# EAGLE design Production_SmartMic_V01 (EAGLE 9.2.2)

## Sheet 1 of 5
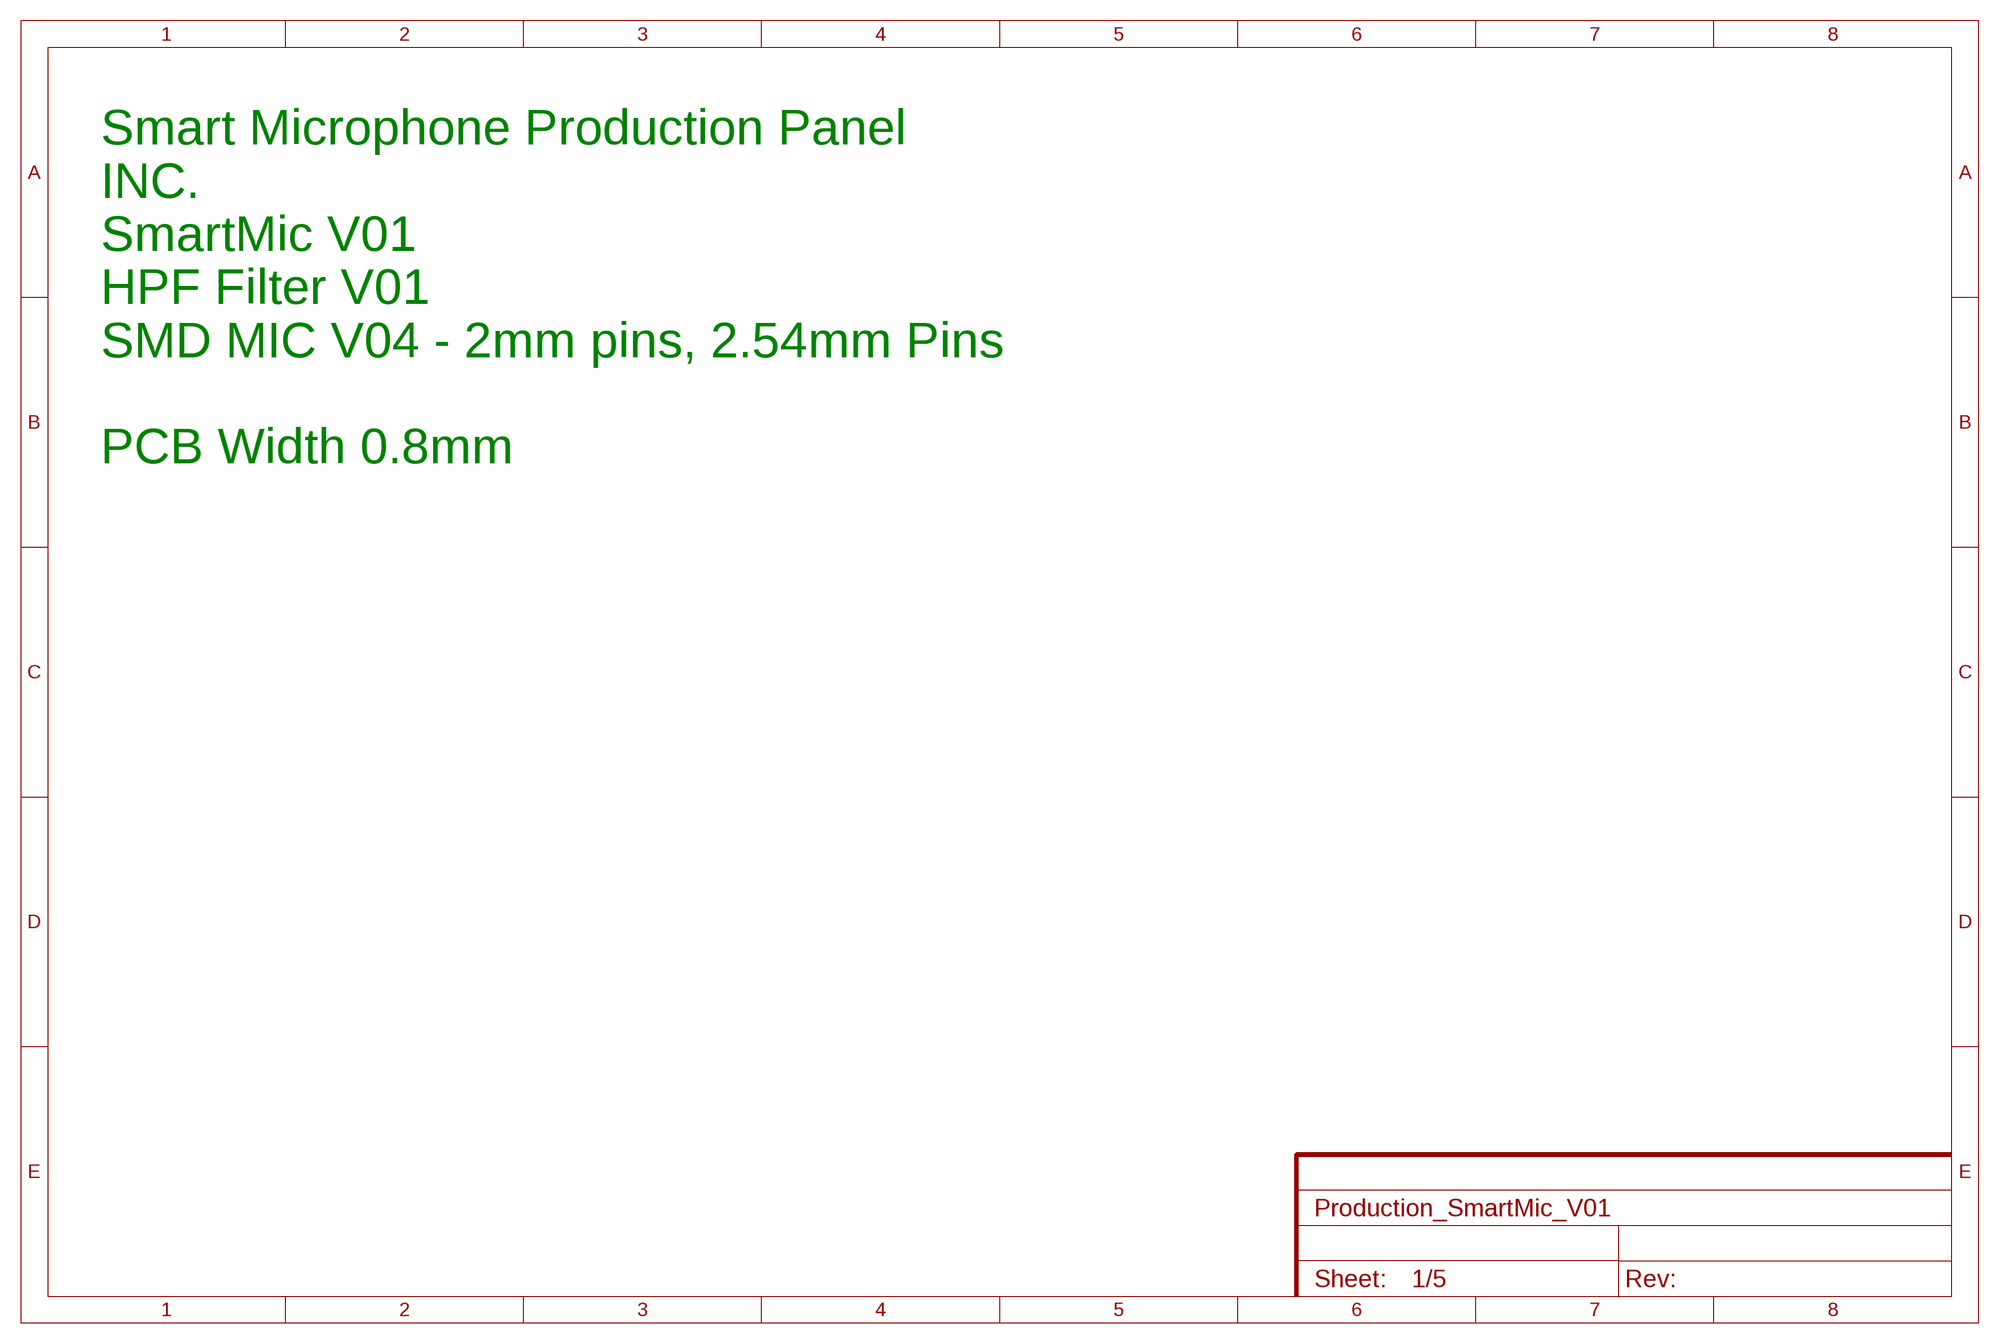
[diagram p0: schematic, sheet 1]

### Notes on the sheet
- Smart Microphone Production Panel
  INC.
  SmartMic V01
  HPF Filter V01
  SMD MIC V04 - 2mm pins, 2.54mm Pins
  
  PCB Width 0.8mm

## Sheet 2 of 5
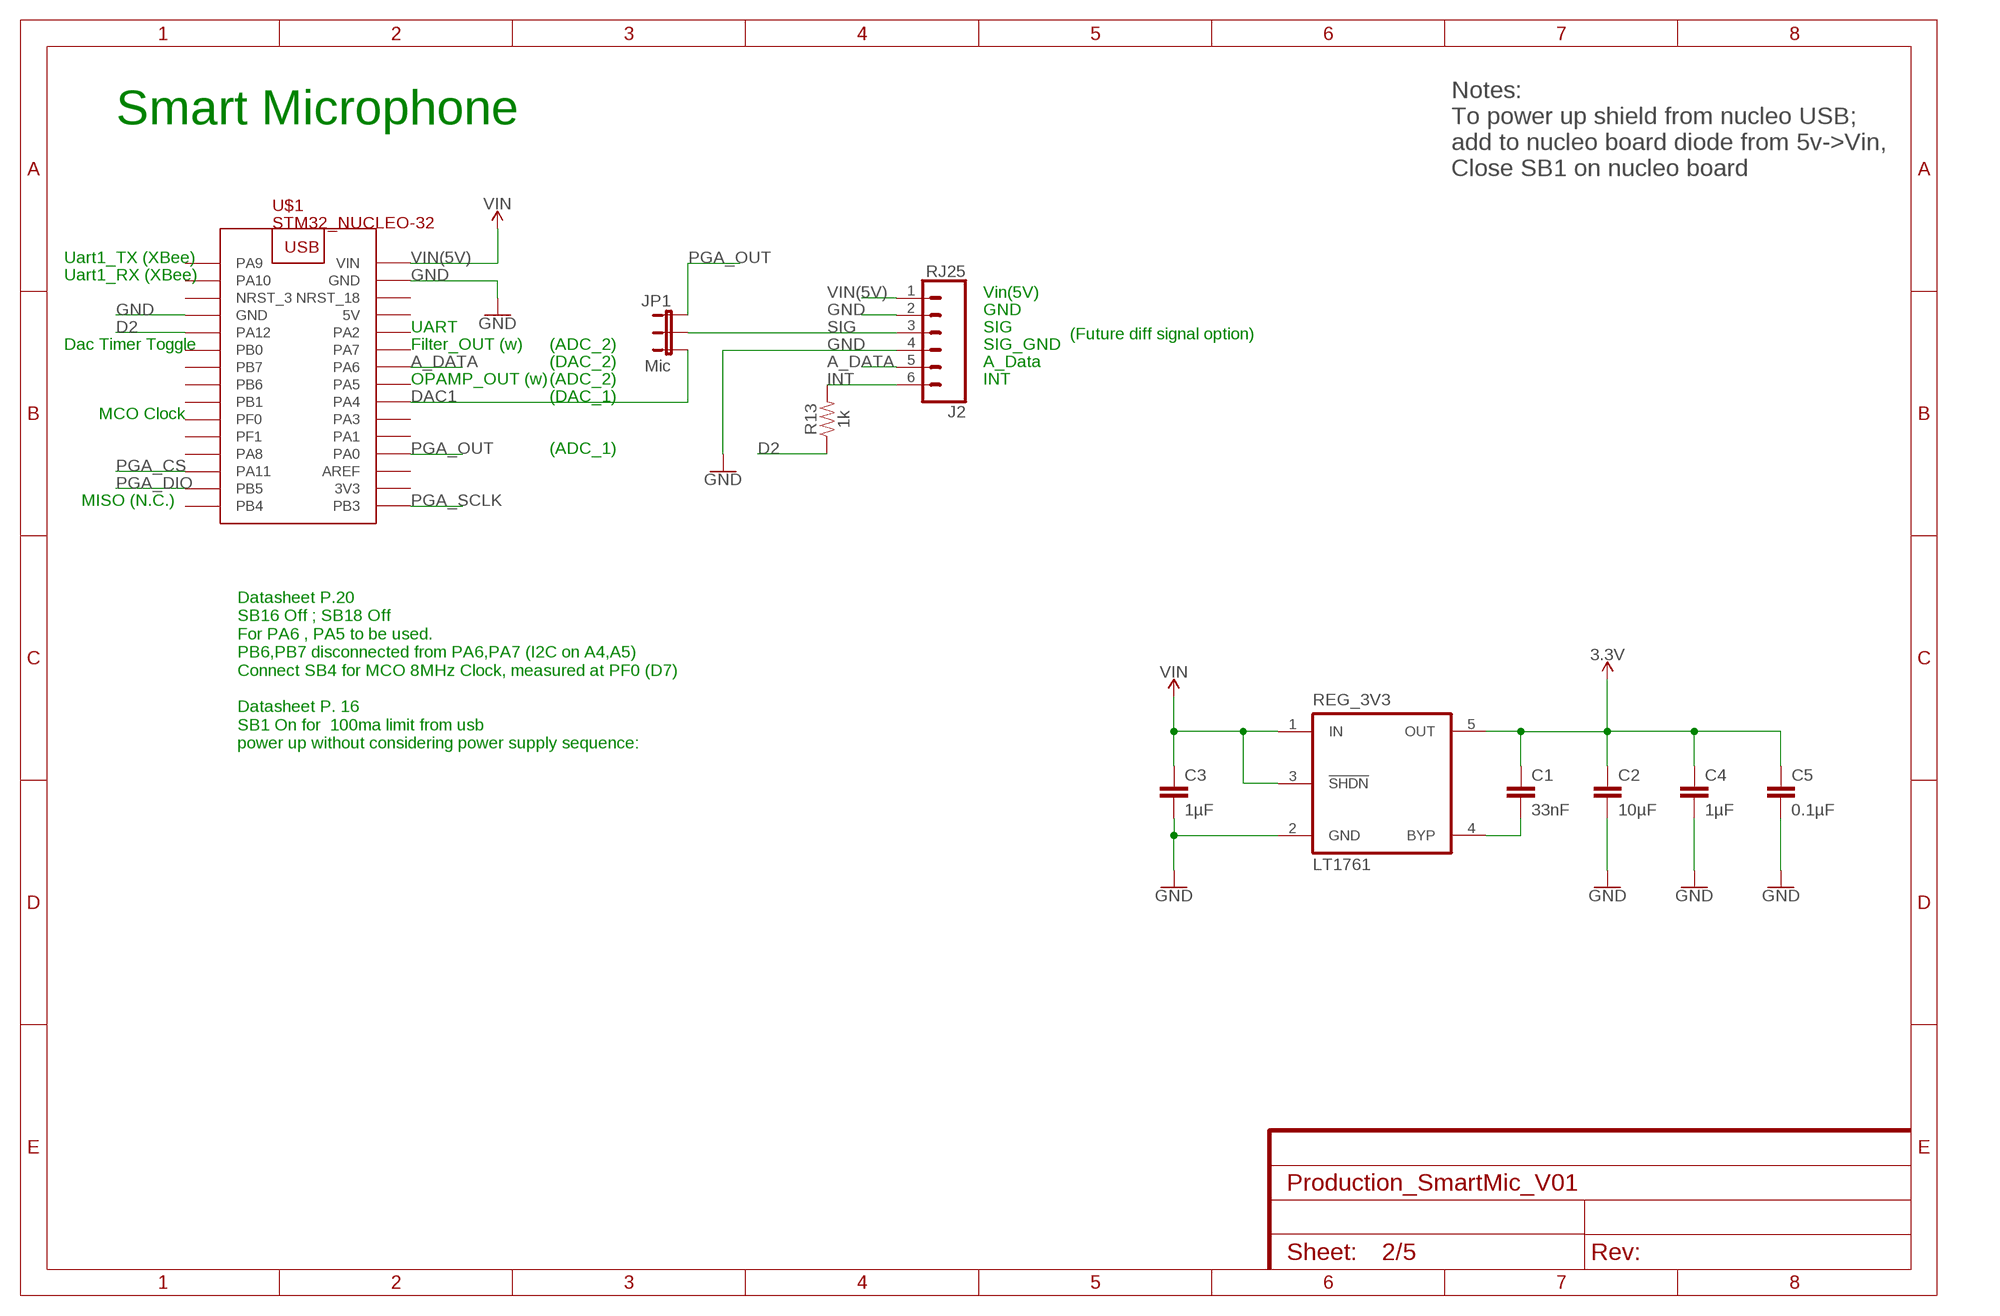
[diagram p1: schematic, sheet 2]

### Parts
C1  33nF  0.33UF/330NF-0805-50V-10%  [0805]
C2  10µF  0.33UF/330NF-0805-50V-10%  [0805]
C3  1µF  0.33UF/330NF-0805-50V-10%  [0805]
C4  1µF  0.33UF/330NF-0805-50V-10%  [0805]
C5  0.1µF  0.33UF/330NF-0805-50V-10%  [0805]
J2  RJ25  RJ11-6  [RJ11-6]
JP1  Mic  JUMPER-3PTH  [1X03]
R13  1k  RESISTOR0805  [0805]
REG_3V3  LT1761  [SOT23-5]
U$1  STM32_NUCLEO-32  [STM32_NUCLEO-32]

### Nets
3.3V: C1.1 C2.1 C4.1 C5.1 REG_3V3.5(OUT) ; also sheet 3,4
A_DATA: J2.5 U$1.PA6
BYP: C1.2 REG_3V3.4(BYP)
D2: R13.1 U$1.PA12
DAC1: JP1.3 U$1.PA4
GND: C2.2 C3.2 C4.2 C5.2 J2.2 J2.4 REG_3V3.2(GND) U$1.GND@4(GND) U$1.GND@17(GND) ; also sheet 3,4
INT: J2.6 R13.2
PGA_CS: U$1.PA11 ; also sheet 3
PGA_DIO: U$1.PB5 ; also sheet 3
PGA_OUT: JP1.1 U$1.PA0 ; also sheet 3
PGA_SCLK: U$1.PB3 ; also sheet 3
SIG: J2.3 JP1.2
VIN(5V): C3.1 J2.1 REG_3V3.1(IN) REG_3V3.3(!SHDN!) U$1.VIN ; supply symbol labelled VIN
Unconnected: U$1.AREF U$1.NRST_3 U$1.NRST_18 U$1.PA1 U$1.PA2 U$1.PA3 U$1.PA5 U$1.PA7 U$1.PA8 U$1.PA9 U$1.PA10 U$1.PB0 U$1.PB1 U$1.PB4 U$1.PB6 U$1.PB7 U$1.PF0 U$1.PF1

### Notes on the sheet
- Smart Microphone
- Notes:
  To power up shield from nucleo USB; 
  add to nucleo board diode from 5v->Vin,
  Close SB1 on nucleo board
- Uart1_TX (XBee)
- Uart1_RX (XBee)
- Vin(5V)
- GND
- UART | SIG
- (Future diff signal option)
- Dac Timer Toggle | Filter_OUT (w) | (ADC_2) | SIG_GND
- (DAC_2) | A_Data
- OPAMP_OUT (w) | (ADC_2) | INT
- (DAC_1)
- MCO Clock
- (ADC_1)
- MISO (N.C.)
- Datasheet P.20
  SB16 Off ; SB18 Off
  For PA6 , PA5 to be used.
  PB6,PB7 disconnected from PA6,PA7 (I2C on A4,A5)
  Connect SB4 for MCO 8MHz Clock, measured at PF0 (D7)
  
  Datasheet P. 16
  SB1 On for  100ma limit from usb 
  power up without considering power supply sequence:

## Sheet 3 of 5
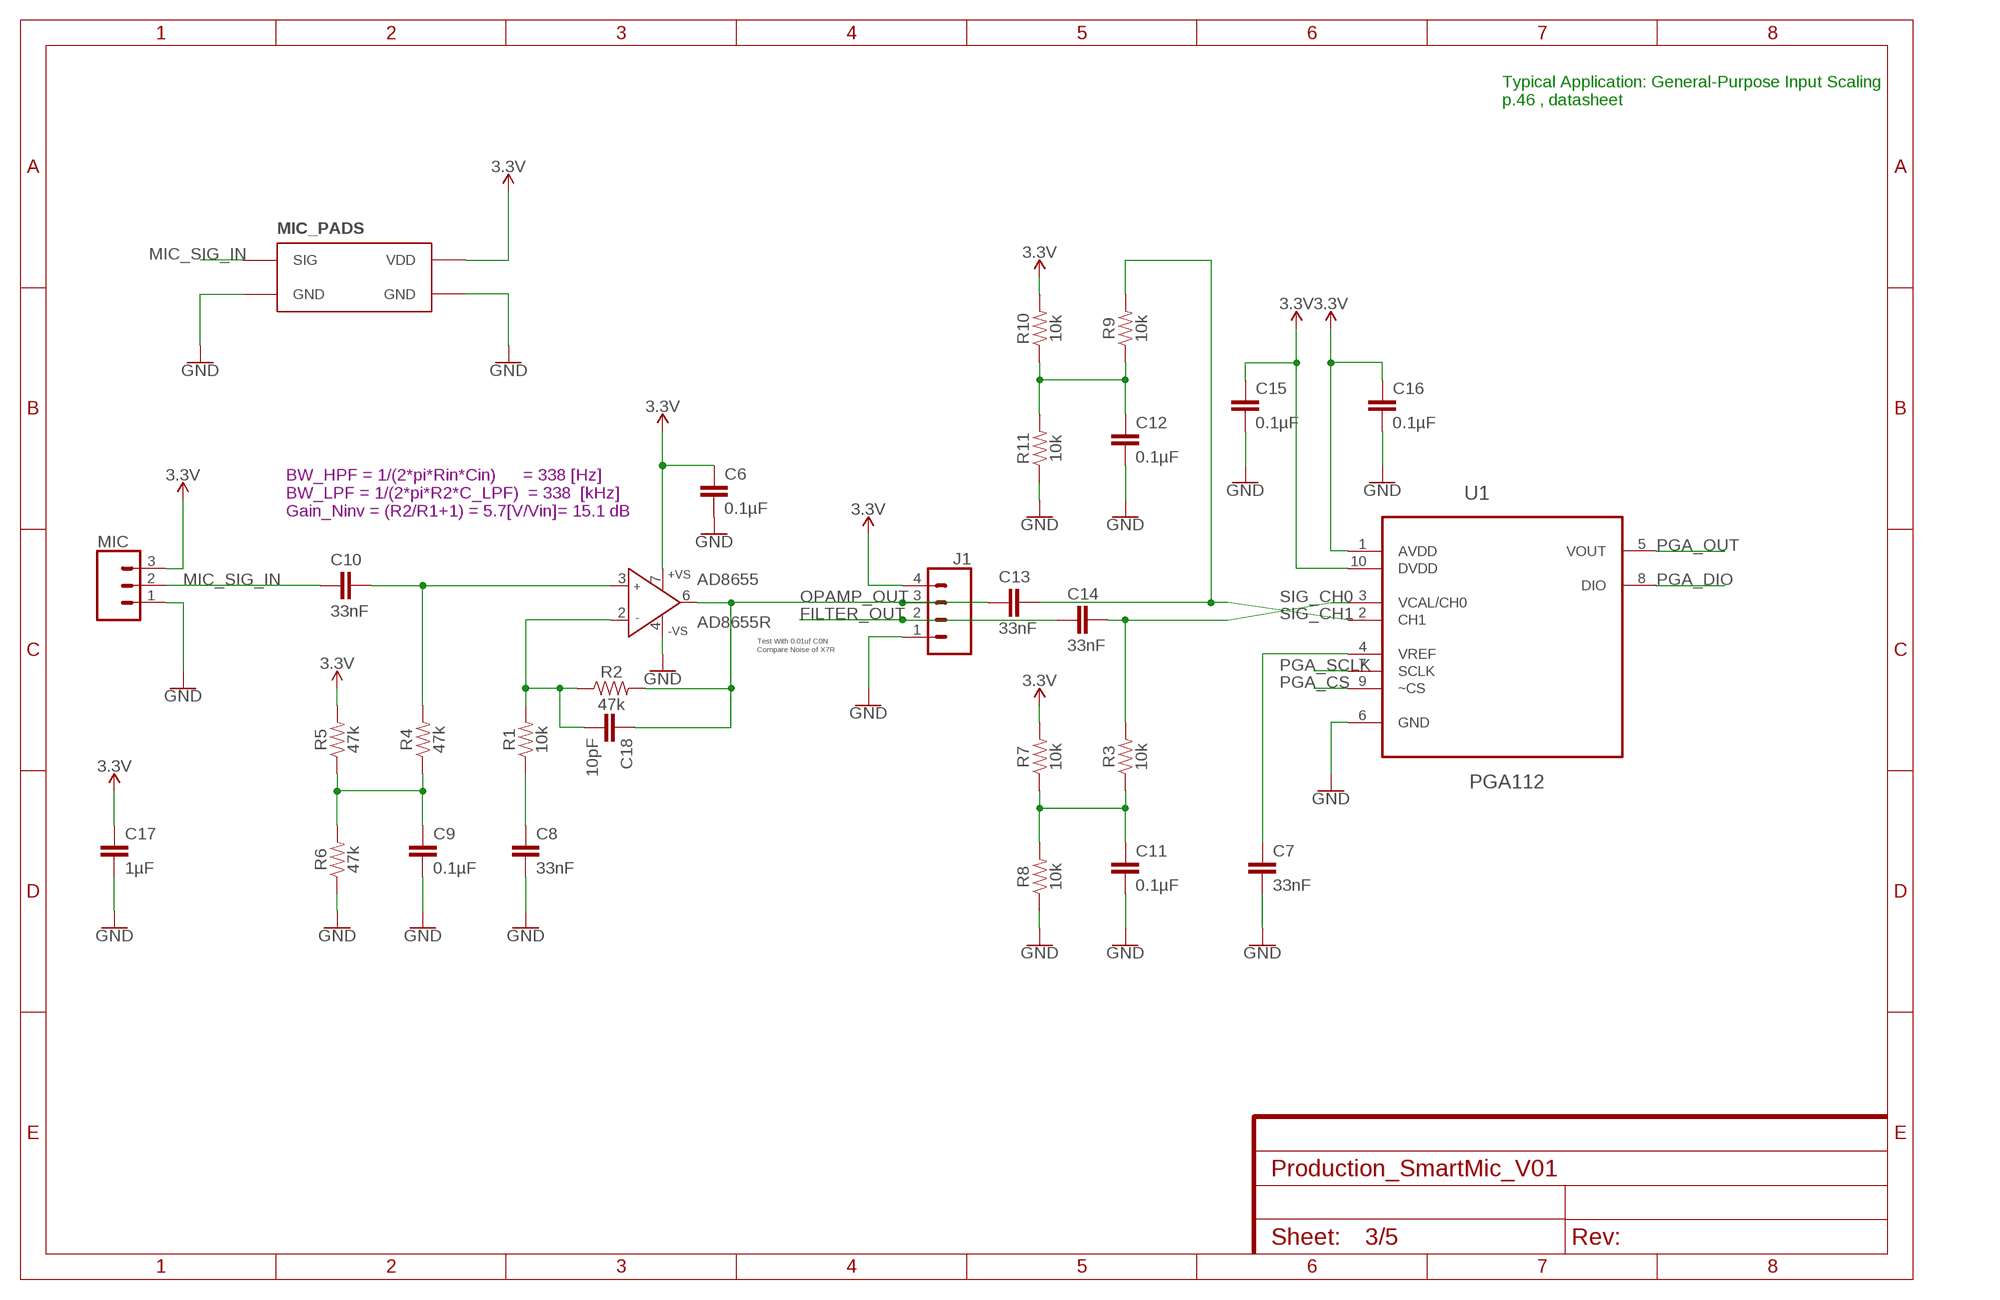
[diagram p2: schematic, sheet 3]

### Parts
AD8655  AD8655R  [SO8]
C6  0.1µF  0.33UF/330NF-0805-50V-10%  [0805]
C7  33nF  0.33UF/330NF-0805-50V-10%  [0805]
C8  33nF  0.33UF/330NF-0805-50V-10%  [0805]
C9  0.1µF  0.33UF/330NF-0805-50V-10%  [0805]
C10  33nF  0.33UF/330NF-0805-50V-10%  [0805]
C11  0.1µF  0.33UF/330NF-0805-50V-10%  [0805]
C12  0.1µF  0.33UF/330NF-0805-50V-10%  [0805]
C13  33nF  0.33UF/330NF-0805-50V-10%  [0805]
C14  33nF  0.33UF/330NF-0805-50V-10%  [0805]
C15  0.1µF  0.33UF/330NF-0805-50V-10%  [0805]
C16  0.1µF  0.33UF/330NF-0805-50V-10%  [0805]
C17  1µF  0.33UF/330NF-0805-50V-10%  [0805]
C18  10pF  0.33UF/330NF-0805-50V-10%  [0805]
J1  CONN_04  [1X04]
MIC  CONN_03  [1X03]
R1  10k  RESISTOR0805  [0805]
R2  47k  RESISTOR0805  [0805]
R3  10k  RESISTOR0805  [0805]
R4  47k  RESISTOR0805  [0805]
R5  47k  RESISTOR0805  [0805]
R6  47k  RESISTOR0805  [0805]
R7  10k  RESISTOR0805  [0805]
R8  10k  RESISTOR0805  [0805]
R9  10k  RESISTOR0805  [0805]
R10  10k  RESISTOR0805  [0805]
R11  10k  RESISTOR0805  [0805]
U1  PGA112  PGA113AIDGST  [SOP50P490X110-10N]
U$2  MIC_PADS  [MIC_PADS]

### Nets
3.3V: AD8655.7(+VS) C6.1 C15.1 C16.1 C17.1 J1.4 MIC.3 R5.2 R7.2 R10.2 U1.1(AVDD) U1.10(DVDD) U$2.VDD ; also sheet 2,4
FILTER_OUT: C14.2 J1.2
GND: AD8655.4(-VS) C6.2 C7.2 C8.2 C9.2 C11.2 C12.2 C15.2 C16.2 C17.2 J1.1 MIC.1 R6.1 R8.1 R11.1 U1.6(GND) U$2.GND$2(GND) U$2.GND$4(GND) ; also sheet 2,4
MIC_SIG_IN: C10.2 MIC.2 U$2.SIG ; also sheet 4
N$1: C7.1 U1.4(VREF)
N$2: C9.1 R4.1 R5.1 R6.2
N$3: C11.1 R3.1 R7.1 R8.2
N$4: C12.1 R9.1 R10.1 R11.2
N$8: C8.1 R1.1
OP1_+: AD8655.3(IN+) C10.1 R4.2
OP1_-: AD8655.2(IN-) C18.2 R1.2 R2.1
OPAMP_OUT: AD8655.6(OUT) C13.2 C18.1 J1.3 R2.2
PGA_CS: U1.9(~CS) ; also sheet 2
PGA_DIO: U1.8(DIO) ; also sheet 2
PGA_OUT: U1.5(VOUT) ; also sheet 2
PGA_SCLK: U1.7(SCLK) ; also sheet 2
SIG_CH0: C13.1 R9.2 U1.2(CH1)
SIG_CH1: C14.1 R3.2 U1.3(VCAL/CH0)

### Notes on the sheet
- Typical Application: General-Purpose Input Scaling 
  p.46 , datasheet
- BW_HPF = 1/(2*pi*Rin*Cin)      = 338 [Hz]
  BW_LPF = 1/(2*pi*R2*C_LPF)  = 338  [kHz]
  Gain_Ninv = (R2/R1+1) = 5.7[V/Vin]= 15.1 dB
- Test With 0.01uf C0N
  Compare Noise of X7R

## Sheet 4 of 5
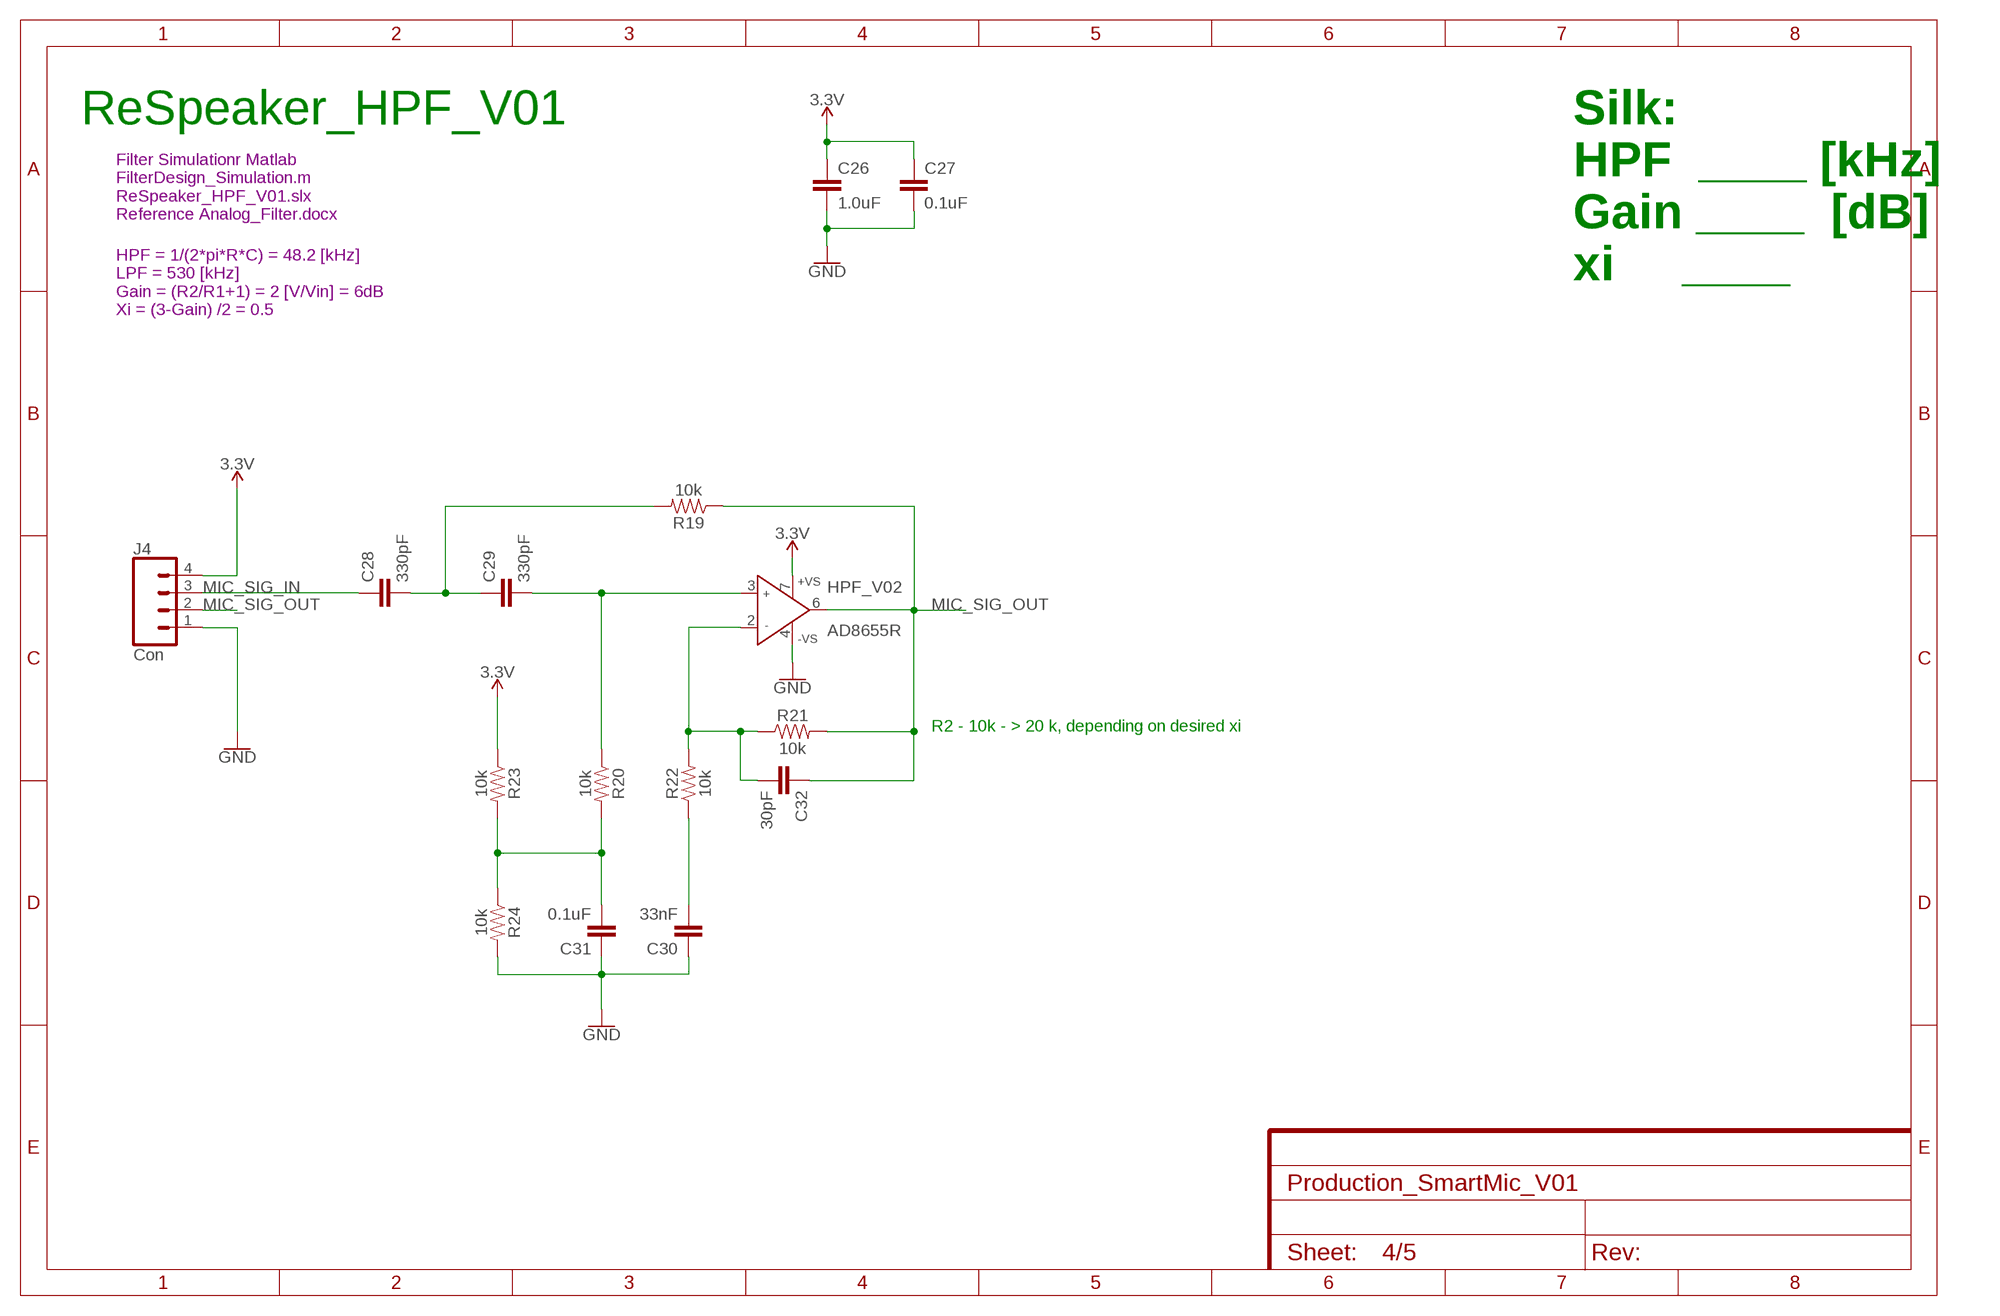
[diagram p3: schematic, sheet 4]

### Parts
C26  1.0uF  1.0UF-0805-25V-10%  [0805]
C27  0.1uF  1.0UF-0805-25V-10%  [0805]
C28  330pF  1.0UF-0805-25V-10%  [0805]
C29  330pF  1.0UF-0805-25V-10%  [0805]
C30  33nF  1.0UF-0805-25V-10%  [0805]
C31  0.1uF  1.0UF-0805-25V-10%  [0805]
C32  30pF  1.0UF-0805-25V-10%  [0805]
HPF_V02  AD8655R  [SO8]
J4  Con  CONN_04  [1X04]
R19  10k  RESISTOR0805  [0805]
R20  10k  RESISTOR0805  [0805]
R21  10k  RESISTOR0805  [0805]
R22  10k  RESISTOR0805  [0805]
R23  10k  RESISTOR0805  [0805]
R24  10k  RESISTOR0805  [0805]

### Nets
3.3V: C26.1 C27.1 HPF_V02.7(+VS) J4.4 R23.1 ; also sheet 2,3
GND: C26.2 C27.2 C30.1 C31.1 HPF_V02.4(-VS) J4.1 R24.2 ; also sheet 2,3
MIC_SIG_IN: C28.1 J4.3 ; also sheet 3
MIC_SIG_OUT: C32.1 HPF_V02.6(OUT) J4.2 R19.1 R21.2
N$11: C28.2 C29.1 R19.2
N$12: C29.2 HPF_V02.3(IN+) R20.1
N$13: C32.2 HPF_V02.2(IN-) R21.1 R22.2
N$14: C30.2 R22.1
N$15: C31.2 R20.2 R23.2 R24.1

### Notes on the sheet
- ReSpeaker_HPF_V01
- Filter Simulationr Matlab
  FilterDesign_Simulation.m
  ReSpeaker_HPF_V01.slx
  Reference Analog_Filter.docx
- Silk:
  HPF  ____ [kHz]
  Gain ____  [dB]
  xi     ____
- HPF = 1/(2*pi*R*C) = 48.2 [kHz]
  LPF = 530 [kHz]
  Gain = (R2/R1+1) = 2 [V/Vin] = 6dB
  Xi = (3-Gain) /2 = 0.5
- R2 - 10k - > 20 k, depending on desired xi

## Sheet 5 of 5
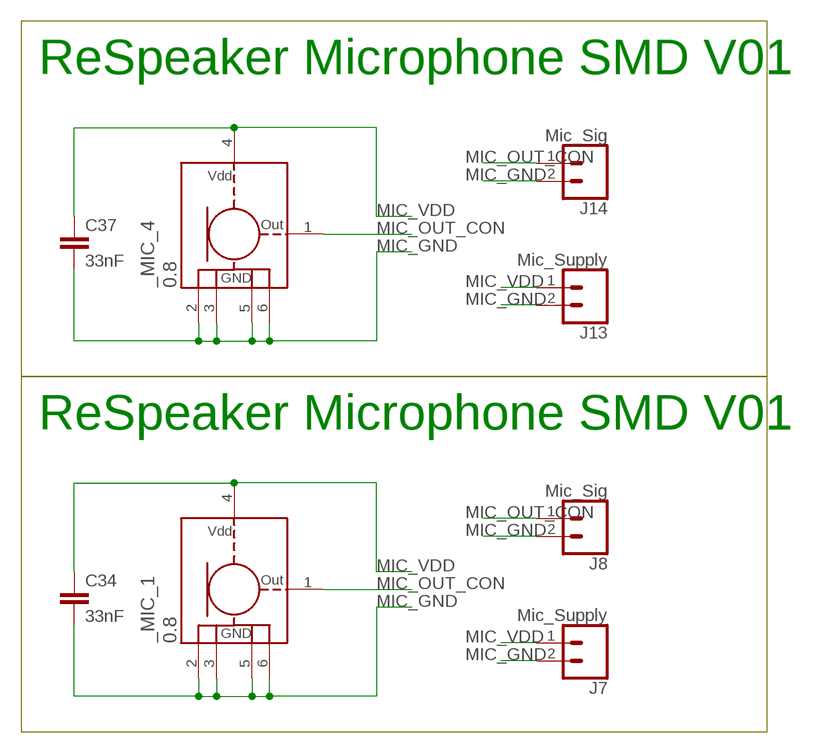
[diagram p4: schematic, sheet 5]

### Parts
_MIC_1  0.8  SPU0410LR5H-QBSPU0410LR5H-QB_0.8  [SPU0410LR5H-QB_0.8]
_MIC_4  0.8  SPU0410LR5H-QBSPU0410LR5H-QB_0.8  [SPU0410LR5H-QB_0.8]
C34  33nF  1.0UF-0805-25V-10%  [0805]
C37  33nF  1.0UF-0805-25V-10%  [0805]
J7  Mic_Supply  CONN_021X02_2MM  [1X02_2.0MM]
J8  Mic_Sig  CONN_021X02_2MM  [1X02_2.0MM]
J13  Mic_Supply  CONN_02  [1X02]
J14  Mic_Sig  CONN_02  [1X02]

### Nets
MIC_GND: _MIC_1.2(GND) _MIC_1.3(GND) _MIC_1.5(GND) _MIC_1.6(GND) _MIC_4.2(GND) _MIC_4.3(GND) _MIC_4.5(GND) _MIC_4.6(GND) C34.2 C37.2 J7.2 J8.2 J13.2 J14.2
MIC_OUT_CON: _MIC_1.1(OUT) _MIC_4.1(OUT) J8.1 J14.1
MIC_VDD: _MIC_1.4(VDD) _MIC_4.4(VDD) C34.1 C37.1 J7.1 J13.1

### Notes on the sheet
- ReSpeaker Microphone SMD V01
- ReSpeaker Microphone SMD V01

## Power pins joined to a net without a drawn wire
3V3: U$1.3V3
5V: U$1.5V

## Library data of the parts
_MIC_1 _MIC_4 = Knowles_Microphone:SPU0410LR5H-QB
AD8655 HPF_V02 = analog-devices:AD8655: Low Noise, Precision CMOS Amplifier Source: http://www.analog.com/static/imported-files/data_sheets/AD8655_8656.pdf; MF: ALTERA CORPORATION; MPN: AD8655ARMZ-REEL; OC_FARNELL: 1078267; OC_NEWARK: 59K7050
C1-C18 = SparkFun-Capacitors:0.33UF/330NF: 0.33µF/330nF ceramic capacitors A capacitor is a passive two-terminal electrical component used to store electrical energy temporarily in an electric field.; PROD_ID: CAP-08469; VALUE: 0.33µF
C26 = SparkFun-Capacitors:1.0UF: 1µF ceramic capacitors A capacitor is a passive two-terminal electrical component used to store electrical energy temporarily in an electric field.; PROD_ID: CAP-08064
C27-C32 C34 C37 = SparkFun-Capacitors:1.0UF: 1µF ceramic capacitors A capacitor is a passive two-terminal electrical component used to store electrical energy temporarily in an electric field.; PROD_ID: CAP-08064; VALUE: 1.0uF
J1 J4 = SparkFun-Connectors:CONN_04: Multi connection point. Often used as Generic Header-pin footprint for 0.1 inch spaced/style header connections On any of the 0.1 inch spaced packages, you can populate with these: Break Away Headers - Straight <https://www.sparkfun.com/products/116> (PRT-00116) Break Away Male Headers - Right Angle <https://www.sparkfun.com/products/553> (PRT-00553) Female Headers <https://www.sparkfun.com/products/115> (PRT-00115) Break Away Headers - Machine Pin <https://www.sparkfun.com/products/117> (PRT-00117) Break Away Female Headers - Swiss Machine Pin <https://www.sparkfun.com/products/743> (PRT-00743) For SCREWTERMINALS and SPRING TERMINALS visit here: Screw Terimnals on SparkFun.com <https://www.sparkfun.com/search/results?term=Screw+Terminals> (5mm/3.5mm/2.54mm spacing) This device is also useful as a general connection point to wire up your design to another part of your project. Our various solder wires solder well into these plated through hole pads. Hook-Up Wire - Assortment (Stranded, 22 AWG) <https://www.sparkfun.com/products/11375> (PRT-11375) Hook-Up Wire - Assortment (Solid Core, 22 AWG) <https://www.sparkfun.com/products/11367> (PRT-11367) View the entire wire category on our website here <https://www.sparkfun.com/categories/141> Special notes: Molex polarized connector foot print use with SKU : PRT-08231 with associated crimp pins and housings. 1MM SMD Version SKU: PRT-10208; PROD_ID: CONN-09696
J2 = SparkFun-Connectors:RJ11-6: RJ11 Jack - 6 pin Commonly found on CAT3 devices and some Microchip programmers. Here is the connector we sell at SparkFun: RJ11 6-Pin Connector <https://www.sparkfun.com/products/132> (PRT-00132) Datasheet <http://www.sparkfun.com/datasheets/Prototyping/Connectors/RJ11-Datasheet.pdf> It is used on this SparkFun product: SparkFun Weather Shield <https://www.sparkfun.com/products/12081> (DEV-12081) Weather Meters <https://www.sparkfun.com/products/8942> (SEN-08942); PROD_ID: CONN-08590; SF_ID: PRT-00132; VALUE: RJ11
J7 J8 = My-Connectors:CONN_02: Multi connection point. Often used as Generic Header-pin footprint for 0.1 inch spaced/style header connections On any of the 0.1 inch spaced packages, you can populate with these: Break Away Headers - Straight <https://www.sparkfun.com/products/116> (PRT-00116) Break Away Male Headers - Right Angle <https://www.sparkfun.com/products/553> (PRT-00553) Female Headers <https://www.sparkfun.com/products/115> (PRT-00115) Break Away Headers - Machine Pin <https://www.sparkfun.com/products/117> (PRT-00117) Break Away Female Headers - Swiss Machine Pin <https://www.sparkfun.com/products/743> (PRT-00743) For SCREWTERMINALS and SPRING TERMINALS visit here: Screw Terimnals on SparkFun.com <https://www.sparkfun.com/search/results?term=Screw+Terminals> (5mm/3.5mm/2.54mm spacing) This device is also useful as a general connection point to wire up your design to another part of your project. Our various solder wires solder well into these plated through hole pads. Hook-Up Wire - Assortment (Stranded, 22 AWG) <https://www.sparkfun.com/products/11375> (PRT-11375) Hook-Up Wire - Assortment (Solid Core, 22 AWG) <https://www.sparkfun.com/products/11367> (PRT-11367) View the entire wire category on our website here <https://www.sparkfun.com/categories/141> Special notes: Molex polarized connector foot print use with: PRT-08233 with associated crimp pins and housings. 2.54_SCREWTERM for use with PRT-10571. 3.5mm Screw Terminal footprints for PRT-08084 5mm Screw Terminal footprints for use with PRT-08432
J13 J14 = SparkFun-Connectors:CONN_02: Multi connection point. Often used as Generic Header-pin footprint for 0.1 inch spaced/style header connections On any of the 0.1 inch spaced packages, you can populate with these: Break Away Headers - Straight <https://www.sparkfun.com/products/116> (PRT-00116) Break Away Male Headers - Right Angle <https://www.sparkfun.com/products/553> (PRT-00553) Female Headers <https://www.sparkfun.com/products/115> (PRT-00115) Break Away Headers - Machine Pin <https://www.sparkfun.com/products/117> (PRT-00117) Break Away Female Headers - Swiss Machine Pin <https://www.sparkfun.com/products/743> (PRT-00743) For SCREWTERMINALS and SPRING TERMINALS visit here: Screw Terimnals on SparkFun.com <https://www.sparkfun.com/search/results?term=Screw+Terminals> (5mm/3.5mm/2.54mm spacing) This device is also useful as a general connection point to wire up your design to another part of your project. Our various solder wires solder well into these plated through hole pads. Hook-Up Wire - Assortment (Stranded, 22 AWG) <https://www.sparkfun.com/products/11375> (PRT-11375) Hook-Up Wire - Assortment (Solid Core, 22 AWG) <https://www.sparkfun.com/products/11367> (PRT-11367) View the entire wire category on our website here <https://www.sparkfun.com/categories/141> Special notes: Molex polarized connector foot print use with: PRT-08233 with associated crimp pins and housings. 2.54_SCREWTERM for use with PRT-10571. 3.5mm Screw Terminal footprints for PRT-08084 5mm Screw Terminal footprints for use with PRT-08432
JP1 = SparkFun-Retired:JUMPER-3
MIC = SparkFun-Connectors:CONN_03: Multi connection point. Often used as Generic Header-pin footprint for 0.1 inch spaced/style header connections On any of the 0.1 inch spaced packages, you can populate with these: Break Away Headers - Straight <https://www.sparkfun.com/products/116> (PRT-00116) Break Away Male Headers - Right Angle <https://www.sparkfun.com/products/553> (PRT-00553) Female Headers <https://www.sparkfun.com/products/115> (PRT-00115) Break Away Headers - Machine Pin <https://www.sparkfun.com/products/117> (PRT-00117) Break Away Female Headers - Swiss Machine Pin <https://www.sparkfun.com/products/743> (PRT-00743) Stackable Header - 3 Pin (Female, 0.1") <https://www.sparkfun.com/products/13875> (PRT-13875) For SCREWTERMINALS and SPRING TERMINALS visit here: Screw Terimnals on SparkFun.com <https://www.sparkfun.com/search/results?term=Screw+Terminals> (5mm/3.5mm/2.54mm spacing) This device is also useful as a general connection point to wire up your design to another part of your project. Our various solder wires solder well into these plated through hole pads. Hook-Up Wire - Assortment (Stranded, 22 AWG) <https://www.sparkfun.com/products/11375> (PRT-11375) Hook-Up Wire - Assortment (Solid Core, 22 AWG) <https://www.sparkfun.com/products/11367> (PRT-11367) View the entire wire category on our website here <https://www.sparkfun.com/categories/141> Special notes: Molex polarized connector foot print use with SKU : PRT-08232 with associated crimp pins and housings.
R1-R11 R13 R19-R24 = SparkFun-Resistors:RESISTOR: Generic Resistor Package
REG_3V3 = linear-technology:LT1761: Regulator 100mA, Low Noise, LDO Micropower fixed output with shutdown control
U1 = Texas Instruments_By_element14_Batch_1:PGA113AIDGST: PROGRAMMABLE GAIN AMPLIFIER with MUX; MPN: PGA113AIDGST; OC_FARNELL: 1755004; OC_NEWARK: 15N0085; PACKAGE: MSOP-10; SUPPLIER: Texas Instruments
U$1 = Stm32_Nucleo-32:STM32_NUCLEO-32: STM32_NUCLEO-32
U$2 = Mic_Connector:MIC_PADS

## Net classes
0 default: width 0.254 mm, drill 0.4 mm, clearance 0.203 mm

## Board
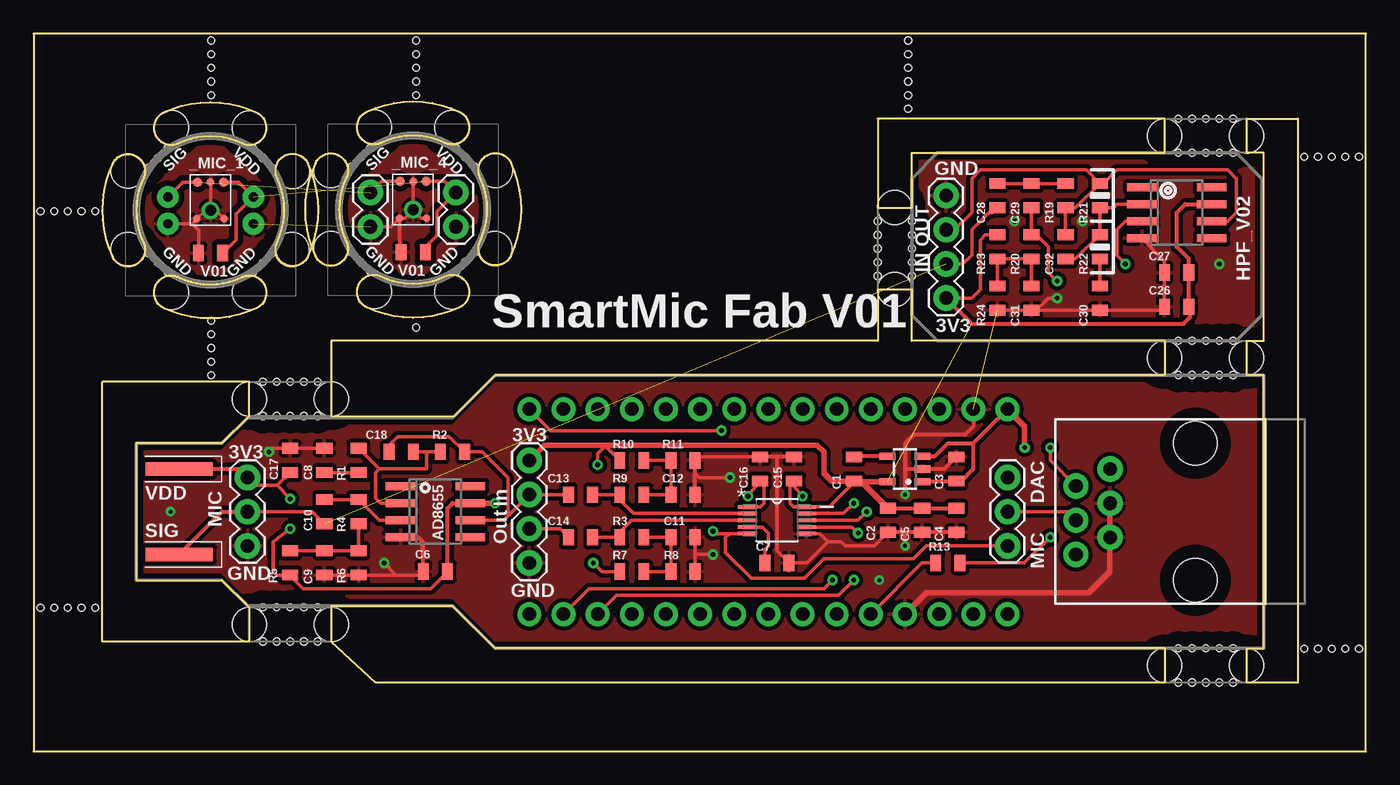
[diagram p5: board, top side]
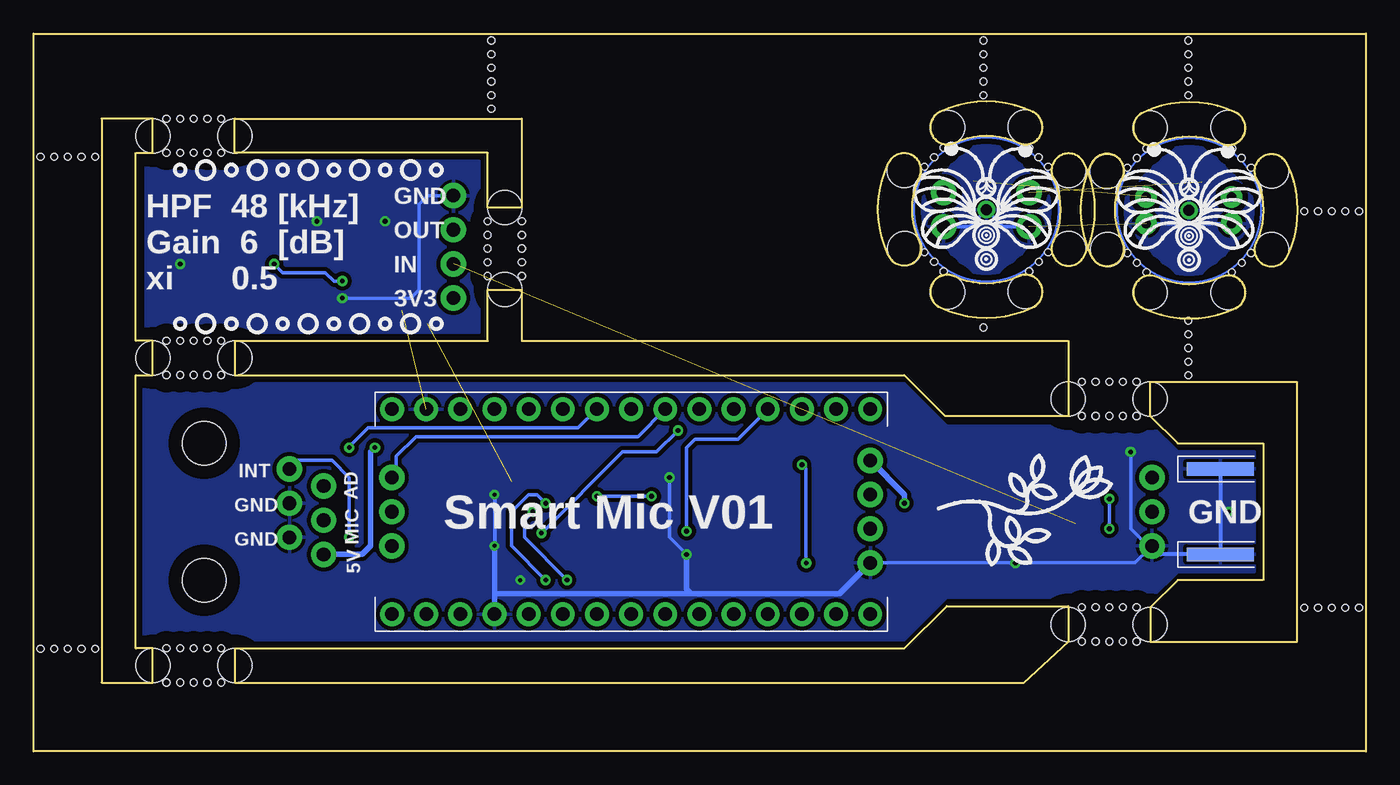
[diagram p6: board, bottom side, seen from below]

Size 99.06 x 53.34 mm. Coordinates in mm from the lower left corner, seen from the top.
Outline: 0,0 99.06,0 99.06,53.34 0,53.34 0,0
Copper layers (1*16): Top 0.035mm / dielectric 1.5mm / Bottom 0.035mm
Design rules "default *": minimum track width 6mil, minimum drill 0.3mm, track to track 6mil, track to pad 6mil, pad to pad 6mil, via to via 6mil, smd to smd 6mil, copper to edge 40mil, drill to drill 6mil, minimum pad ring 10mil, minimum via ring 8mil, stop-mask expansion 4mil, vias tented up to drill 20mil, thermal gap 10mil
Holes 2.54 mm at 16.03,9.42 22.12,9.42 16.03,26.19 22.12,26.19 84.1,6.38 90.2,6.38 84.1,29.24 90.2,29.24 84.1,45.75 90.2,45.75 64.03,34.32 64.03,40.41 7.01,43.13 7.01,37.31 10.24,34.11 16.03,34.09 19.2,37.31 19.25,43.1 16.03,46.33 10.24,46.35 22.1,43.18 22.1,37.36 25.32,34.16 31.11,34.14 34.29,37.36 34.34,43.15 31.11,46.38 25.32,46.41
Holes 0.51 mm at 17.04,10.69 18.06,10.69 19.08,10.69 20.09,10.69 21.11,10.69 17.04,8.15 18.06,8.15 19.08,8.15 20.09,8.15 21.11,8.15 17.04,27.46 18.06,27.46 19.08,27.46 20.09,27.46 21.11,27.46 17.04,24.92 18.06,24.92 19.08,24.92 20.09,24.92 21.11,24.92 85.12,7.65 86.13,7.65 87.15,7.65 88.16,7.65 89.18,7.65 85.12,5.11 86.13,5.11 87.15,5.11 88.16,5.11 89.18,5.11 85.12,30.51 86.13,30.51 87.15,30.51 88.16,30.51 89.18,30.51 85.12,27.97 86.13,27.97 87.15,27.97 88.16,27.97 89.18,27.97 85.12,47.02 86.13,47.02 87.15,47.02 88.16,47.02 89.18,47.02 85.12,44.48 86.13,44.48 87.15,44.48 88.16,44.48 89.18,44.48 62.76,35.33 62.76,36.35 62.76,37.36 62.76,38.38 62.76,39.4 65.3,35.33 65.3,36.35 65.3,37.36 65.3,38.38 65.3,39.4 8.53,43.38 9.25,44.09 9.93,44.81 16.31,44.81 17.02,44.09 17.73,43.38 17.73,37.03 17.02,36.32 16.31,35.61 9.96,35.61 9.22,36.32 8.53,37.03 23.62,43.43 24.33,44.15 25.02,44.86 31.39,44.86 32.11,44.15 32.82,43.43 32.82,37.08 32.11,36.37 31.39,35.66 25.04,35.66 24.31,36.37 23.62,37.08 98.55,7.62 97.54,7.62 96.52,7.62 95.5,7.62 94.49,7.62 0.51,10.67 1.52,10.67 2.54,10.67 3.56,10.67 4.57,10.67 98.55,44.2 97.54,44.2 96.52,44.2 95.5,44.2 94.49,44.2 65.02,47.75 65.02,48.77 65.02,49.78 65.02,50.8 65.02,51.82 65.02,52.83 4.57,40.13 3.56,40.13 2.54,40.13 1.52,40.13 0.51,40.13 13.21,48.77 13.21,49.78 13.21,50.8 13.21,51.82 13.21,52.83 28.45,48.77 28.45,49.78 28.45,50.8 28.45,51.82 28.45,52.83 13.21,27.94 13.21,28.96 13.21,29.97 13.21,30.99 13.21,32 28.45,31.5
Milling: 77 lines

### Footprints (pad centres in the part's own frame; a part is rotated, then mirrored left to right if it is on the bottom)
SPU0410LR5H-QB_0.8 = smd 0.723 x 0.723: 1 -0.966,2.103; 4 0.966,2.103 | smd 0.562 x 0.562: 2 -1.015,-0.634; 3 1.015,-0.634 | smd 0.612 x 0.612: 5 0,2.103 | drill 0.8 pad 1.2: 6 0,0
SO8 = smd 0.6 x 2.2: 1 -1.905,-2.6; 2 -0.635,-2.6; 3 0.635,-2.6; 4 1.905,-2.6; 5 1.905,2.6; 6 0.635,2.6; 7 -0.635,2.6; 8 -1.905,2.6
0805 = smd 0.8 x 1.2: 1 -0.9,0; 2 0.9,0
1X04 = drill 1.016 pad 1.88: 1 0,0; 2 2.54,0; 3 5.08,0; 4 7.62,0
RJ11-6 = drill 1.016 pad 1.88: 1 -3.175,8.89; 2 -1.905,6.35; 3 -0.635,8.89; 4 0.635,6.35; 5 1.905,8.89; 6 3.175,6.35 | hole 3.251: -5.08,0; 5.08,0
1X02_2.0MM = drill 0.7 pad 1.6: 1 -1,0; 2 1,0
1X02 = drill 1.016 pad 1.88: 1 0,0; 2 2.54,0
1X03 = drill 1.016 pad 1.88: 1 0,0; 2 2.54,0; 3 5.08,0
SOT23-5 = smd 0.55 x 1.2: 1 -0.95,-1.3; 2 0,-1.3; 3 0.95,-1.3; 4 0.95,1.3; 5 -0.95,1.3
SOP50P490X110-10N = smd 1.422 x 0.279: 1 -2.184,0.991; 2 -2.184,0.508; 3 -2.184,0; 4 -2.184,-0.508; 5 -2.184,-0.991; 6 2.184,-0.991; 7 2.184,-0.508; 8 2.184,0; 9 2.184,0.508; 10 2.184,0.991
STM32_NUCLEO-32 = drill 1 pad 1.778: 3V3 16.51,3.81; 5V 16.51,29.21; AREF 16.51,6.35; GND@4 1.27,29.21; GND@17 16.51,34.29; NRST_3 1.27,31.75; NRST_18 16.51,31.75; PA0 16.51,8.89; PA1 16.51,11.43; PA2 16.51,26.67; PA3 16.51,13.97; PA4 16.51,16.51; PA5 16.51,19.05; PA6 16.51,21.59; PA7 16.51,24.13; PA8 1.27,8.89; PA9 1.27,36.83; PA10 1.27,34.29; PA11 1.27,6.35; PA12 1.27,26.67; PB0 1.27,24.13; PB1 1.27,16.51; PB3 16.51,1.27; PB4 1.27,1.27; PB5 1.27,3.81; PB6 1.27,19.05; PB7 1.27,21.59; PF0 1.27,13.97; PF1 1.27,11.43; VIN 16.51,36.83
MIC_PADS = smd 5 x 1 bottom: GND$2 3.175,-3.175; GND$4 3.175,3.175 | smd 5 x 1: SIG 3.175,-3.175; VDD 3.175,3.175

### Placement (x,y rotation side)
_MIC_1  13.16,40.21 0 top
_MIC_4  28.22,40.26 0 top
AD8655  29.87,17.81 270 top
C1  60.99,20.98 90 top
C2  63.53,17.17 270 top
C3  68.61,20.98 90 top
C4  68.61,17.17 270 top
C5  66.07,17.17 270 top
C6  29.87,13.36 180 top
C7  55.27,14 0 top
C8  21.62,21.62 90 top
C9  21.62,14 270 top
C10  21.62,17.81 270 top
C11  48.29,15.9 0 top
C12  48.29,19.08 0 top
C13  40.67,19.08 180 top
C14  40.67,15.9 180 top
C15  56.54,20.98 90 top
C16  54,20.98 90 top
C17  19.08,21.62 90 top
C18  27.33,22.25 0 top
C26  84.99,33.05 180 top
C27  84.99,35.59 180 top
C28  71.65,41.3 90 top
C29  74.19,41.3 270 top
C30  79.27,33.68 90 top
C31  74.19,33.68 90 top
C32  76.73,37.49 270 top
C34  13.16,37.03 180 top
C37  28.22,37.08 180 top
HPF_V02  84.99,40.03 270 top
J1  36.86,14 90 top
J2  86.39,17.81 90 top
J4  67.84,41.3 270 top
J7  16.33,40.21 270 top
J8  9.98,40.21 270 top
J13  31.39,41.53 270 top
J14  25.04,41.53 270 top
JP1  72.42,15.27 90 top
MIC  15.9,15.27 90 top
R1  24.16,21.62 90 top
R2  31.14,22.25 0 top
R3  44.48,15.9 180 top
R4  24.16,17.81 90 top
R5  19.08,14 270 top
R6  24.16,14 90 top
R7  44.48,13.36 180 top
R8  48.29,13.36 180 top
R9  44.48,19.08 180 top
R10  44.48,21.62 180 top
R11  48.29,21.62 180 top
R13  67.97,14 0 top
R19  76.73,41.3 90 top
R20  74.19,37.49 270 top
R21  79.27,41.3 90 top
R22  79.27,37.49 90 top
R23  71.65,37.49 270 top
R24  71.65,33.68 270 top
REG_3V3  64.8,20.98 90 top
U1  55.27,17.17 0 top
U$1  35.59,8.92 90 bottom
U$2  7.65,17.81 0 top

### Tracks (layer width: path | path; a pad name or v marks a point on that pad's centre or on a via)
3.3V  (via drill 0.35)  (1 unrouted)
  Top 0.254: 61.03,20.03 59.17,18.16 U1.10 56.5,18.16 56.22,18.44 56.22,20.08 | C6.1 29.5,12.09 20.03,12.09 19.07,13.04 R5.2 18.07,13.1 17.8,13.36 17.8,15.58 v19.07,16.54 | v19.07,18.76 18.12,19.76 | 18.12,19.76 C17.1 | 18.12,19.76 16.48,19.76 MIC.3 | U1.1 54.04,18.16 54.32,18.44 54.32,19.76 C16.1 53.49,19.45 v53.11,18.95 | R10.2 42.57,22.62 42.57,22.76 41.94,22.12 v41.94,21.3 | R7.2 42.25,13.36 v41.62,13.99 | v57.17,18.95 56.54,19.71 C15.1 | J4.4 69.75,33.68 70.38,34.31 70.38,38 70.76,38.38 71.64,38.38 R23.1
  Top 0.305: C2.1 C5.1 C4.1 | C1.1 61.03,20.03 61.56,20.03 | C15.1 56.22,20.08 | C6.1 30.77,18.07 31.14,18.44 AD8655.7 | U$2.VDD 15.27,20.98 MIC.3 | J4.4 69.75,31.77 85.5,31.77 86,32.28 86,32.93 C26.1 C27.1 85.89,36.59 84.99,37.49 84.99,40.03 85.62,40.66 HPF_V02.7
  Top 0.406: REG_3V3.5 61.56,20.03 C2.1 | C1.1 59.34,20.08 58.76,20.66 58.76,22.25 58.26,22.76 42.57,22.76 38,22.76 J1.4 | v34.31,18.44 AD8655.7
  Bottom 0.254: v19.07,16.54 v19.07,18.76 | v41.94,21.3 41.62,20.98 v41.62,13.99 | v53.11,18.95 v57.17,18.95
  Bottom 0.406: J1.4 34.31,19.07 v34.31,18.44
A_DATA  (via drill 0.35)
  Top 0.254: v75.59,22.57 75.59,21.61 J2.5
  Bottom 0.254: U$1.PA6 58.57,24.03 74.19,24.03 75.59,22.63 v75.59,22.57
BYP
  Top 0.305: REG_3V3.4 61.03,21.93 C1.2
D2
  Top 0.254: U$1.PA12 66.06,13.99 R13.1
DAC1
  Bottom 0.254: JP1.3 72.1,20.66 72.1,21.93 70.64,23.39 54.13,23.39 U$1.PA4
FILTER_OUT
  Top 0.254: J1.2 39.13,16.54 C14.2
GND  (via drill 0.3, 0.35)  (1 unrouted)
  Top 0.254: 63.44,16.18 C2.2 62.52,15.27 60.35,15.27 60.03,15.58 59.08,15.58 | R8.1 49.19,14.63 | 49.19,14.63 C11.2 | C8.2 C17.2 17.75,22.52 v17.49,22.25 | C9.2 R6.1 26.96,13.1 | 26.96,13.1 28.7,13.1 C6.2 | 59.08,15.58 57.49,13.99 C7.2 55.27,14.89 55.27,21.88 | v26.06,13.99 26.96,13.1 | C16.2 49.45,21.88 R11.1 | U1.6 58.48,16.18 59.08,15.58 | 49.19,14.63 v50.51,14.63 | 49.19,20.66 49.5,20.34 v51.78,20.34 | R24.2 C31.1 | C31.1 C30.1 83.82,32.78 C26.2 C27.2 84.09,36.42 HPF_V02.4 | C31.1 74.56,32.78 75.46,33.68 v76.1,33.68
  Top 0.305: C3.2 67.7,20.98 REG_3V3.2 64.8,20.98 | C4.2 C5.2 64.8,16.27 | 64.8,16.27 C2.2 | U$1.GND@17 69.88,24.16 69.24,23.52 65.43,23.52 64.8,22.89 64.8,20.98 | 64.8,20.98 v64.8,19.07 | v64.8,15.27 64.8,16.27 | C15.2 55.27,21.88 C16.2 | C12.2 49.19,20.66 R11.1 | C6.2 28.97,15.53 28.6,15.9 AD8655.4
  Top 0.406: J2.4 J2.2 80.03,13.36 78.45,11.77 66.38,11.77 U$1.GND@4
  Bottom 0.254: MIC.1 16.06,15.11 | 16.06,15.11 17.17,13.99 v26.06,13.99 J1.1 | v17.49,22.25 17.49,16.54 16.06,15.11 | v51.78,20.34 51.78,15.9 v50.51,14.63 | v76.1,33.68 71.02,33.68 70.38,34.31 70.38,40.66 69.75,41.3 J4.1
  Bottom 0.305: v64.8,19.07 v64.8,15.27 | MIC.1 15.27,14.63 U$2.GND$2 U$2.GND$4
  Bottom 0.406: U$1.GND@4 64.8,11.71 | 64.8,11.71 v64.8,15.27 | J1.1 39.14,11.71 50.19,11.71 | 50.19,11.71 64.8,11.71 | 50.19,11.71 50.51,12.03 v50.51,14.63
  other vias: 62.89,12.73 10.19,17.81 72.92,39.4 88.16,36.22 78,39.4
  pour Bottom (isolate 0.305): 8.28,13.36 14,13.36 15.9,11.46 31.14,11.46 34.32,8.28 90.83,8.28 90.83,27.33 34.32,27.33 31.14,24.16 15.9,24.16 14,22.25 8.28,22.25
  pour Top (isolate 0.305): 8.28,13.36 14,13.36 15.9,11.46 31.14,11.46 34.32,8.28 90.83,8.28 90.83,27.33 34.32,27.33 31.14,24.16 15.9,24.16 14,22.25 8.28,22.25
  pour Bottom (isolate 0.305): 65.94,31.14 90.7,31.14 90.7,43.84 65.94,43.84
  pour Top (isolate 0.305): 65.94,31.14 90.7,31.14 90.7,43.84 65.94,43.84
INT  (via drill 0.35)
  Top 0.254: R13.2 73.69,13.99 v75.59,15.9
  Bottom 0.254: v75.59,15.9 75.59,20.34 76.86,21.61 79.4,21.61 J2.6
MIC_GND  (1 unrouted)
  Top 0.254: 11.78,39.21 _MIC_1.2 12.78,40.21 _MIC_1.6 | 11.78,39.21 J8.2 | C34.2 12.26,38.73 11.78,39.21 | _MIC_1.3 13.54,40.21 _MIC_1.6 | _MIC_1.6 _MIC_1.5 | _MIC_4.6 27.59,39.62 _MIC_4.2 | _MIC_4.3 28.85,39.62 _MIC_4.6 | _MIC_4.2 27.2,37.2 C37.2 | _MIC_4.2 26.57,38.99 J14.2 | _MIC_4.5 _MIC_4.6
  Bottom 0.254: J7.2 J8.2 | J13.2 29.49,38.99 _MIC_4.6 26.95,38.99 J14.2
  pour Top (isolate 0.406): 7.44,34.49 18.87,34.49 18.87,45.92 7.44,45.92
  pour Bottom (isolate 0.406): 7.44,34.49 18.87,34.49 18.87,45.92 7.44,45.92
  pour Top (isolate 0.406): 22.5,34.54 33.93,34.54 33.93,45.97 22.5,45.97
  pour Bottom (isolate 0.406): 22.5,34.54 33.93,34.54 33.93,45.97 22.5,45.97
MIC_OUT_CON  (1 unrouted)
  Top 0.254: J8.1 11.09,42.31 _MIC_1.1 | _MIC_4.1 25.88,42.36 J14.1
MIC_SIG_IN  (1 unrouted)
  Top 0.254: C10.2 20.71,17.8 MIC.2 | J4.3 69.11,36.22 69.75,36.85 69.75,38.76 71.02,40.03 71.28,40.03 C28.1
  Top 0.305: U$2.SIG 13.99,17.8 MIC.2
MIC_SIG_OUT
  Top 0.254: C32.1 R19.1 77.47,40.4 R21.2 | J4.2 68.48,38.76 69.75,40.03 69.75,42.57 70.38,43.2 78.27,43.2 R21.2 | R21.2 79.54,42.2 80.54,43.2 88.8,43.2 89.43,42.57 89.43,40.03 88.8,39.4 HPF_V02.6
MIC_VDD  (1 unrouted)
  Top 0.254: _MIC_1.4 15.23,42.31 J7.1 15.06,39.94 15.06,38.04 C34.1 | _MIC_4.4 30.56,42.36 J13.1 30,40.13 30,38.35 29.12,37.48 C37.1
N$1
  Top 0.254: C7.1 54.37,15 54.63,15.27 54.63,16.22 54.19,16.66 U1.4
N$2
  Top 0.254: R5.1 C9.1 R6.2 R4.1
N$3
  Top 0.254: R3.1 C11.1 R8.2 R7.1
N$4
  Top 0.254: R10.1 R11.2 C12.1 R9.1
N$8
  Top 0.254: R1.1 C8.1
N$11
  Top 0.254: C28.2 C29.1 R19.2
N$12  (via drill 0.35)
  Top 0.254: C29.2 R20.1 74.56,38.39 75.46,37.49 75.46,35.59 v76.1,34.95 | HPF_V02.3 81.18,39.4 80.54,38.76 80.54,36.85 v81.18,36.22
  Bottom 0.254: v76.1,34.95 76.73,34.95 77.37,35.59 80.54,35.59 v81.18,36.22
N$13
  Top 0.254: C32.2 77.47,36.59 R22.2 R21.1 80.28,40.4 80.54,40.66 HPF_V02.2
N$14
  Top 0.254: C30.2 R22.1
N$15
  Top 0.254: R24.1 R23.2 R20.2 C31.2
OP1_+
  Top 0.254: C10.1 R4.2 25.69,17.17 AD8655.3
OP1_-
  Top 0.254: R2.1 29.23,22.25 | 29.23,22.25 C18.2 | 29.23,22.25 29.23,20.98 25.69,20.98 | R1.2 25.69,20.98 | AD8655.2 25.81,18.44 25.43,18.82 25.43,20.71 25.69,20.98
OPAMP_OUT
  Top 0.254: C13.2 J1.3 35.27,17.49 | AD8655.6 34.95,17.17 35.27,17.49 | 26.43,22.3 C18.1 26.43,22.75 27.08,23.39 30.9,23.39 R2.2 33.36,22.25 35.27,20.34 35.27,17.49
PGA_CS  (via drill 0.35)
  Top 0.254: U1.9 60.22,17.68 v60.98,18.44 | U$1.PA11 43.33,11.58 59.84,11.58 v60.98,12.72
  Bottom 0.254: v60.98,18.44 61.62,19.07 62.26,19.07 63.52,17.8 63.52,15.27 v60.98,12.72
PGA_DIO  (via drill 0.35)
  Top 0.254: U1.8 61.3,17.17 v61.94,17.8 | U$1.PB5 41.3,12.09 58.76,12.09 v59.4,12.72
  Bottom 0.254: v61.94,17.8 62.57,17.17 62.57,15.9 v59.4,12.72
PGA_OUT  (via drill 0.35)
  Top 0.254: JP1.1 66.38,15.27 65.43,14.31 58.76,14.31 57.3,12.85 53.37,12.85 51.46,14.76 51.46,15.9 51.74,16.18 | U1.5 51.74,16.18 | v50.51,16.36 50.69,16.18 51.74,16.18
  Bottom 0.254: U$1.PA0 46.7,23.2 49.87,23.2 50.51,22.57 v50.51,16.36
PGA_SCLK  (via drill 0.35)
  Top 0.254: U1.7 60.86,16.66 v61.3,16.22 | U$1.PB3 38.44,23.84 v51.14,23.84
  Bottom 0.254: v61.3,16.22 55.27,22.25 52.73,22.25 v51.14,23.84
SIG
  Top 0.254: JP1.2 76.86,17.8 J2.3
SIG_CH0
  Top 0.254: U1.2 44.6,17.68 43.58,18.7 R9.2 C13.1
SIG_CH1
  Top 0.254: C14.1 R3.2 43.58,16.27 44.48,17.17 U1.3
VIN(5V)  (via drill 0.35)
  Top 0.305: REG_3V3.1 66.14,20.08 C3.1 68.97,20.08 69.88,20.98 69.88,22.89 | 69.88,22.89 U$1.VIN | REG_3V3.3 67.02,21.93 67.97,22.89 69.88,22.89
  Top 0.406: v73.69,22.57 73.69,24.16 U$1.VIN
  Bottom 0.406: J2.1 74.64,14.63 74,15.27 74,22.25 v73.69,22.57
(copper drawn outside any net)
  shapes: Bottom circle x2, Top circle x2

### Text on the board
tPlace: VDD | VDD | SIG | SIG | GND | GND | GND | GND | GND | OUT | IN | V01 | V01 | SmartMic Fab V01 | 3V3 | 3V3 | 3V3 | DAC | VDD | In | SIG | MIC | Out | GND | GND
bPlace: GND | OUT | IN | HPF 48 [kHz] / Gain 6 [dB] / xi 0.5 | 3V3 | INT | AD | MIC | GND | GND | Smart Mic V01 | GND | 5V